# Altium schematic sheet BAT_PROTECTOR.SchDoc
size A4; SheetNumber: 4; SheetTotal: 4
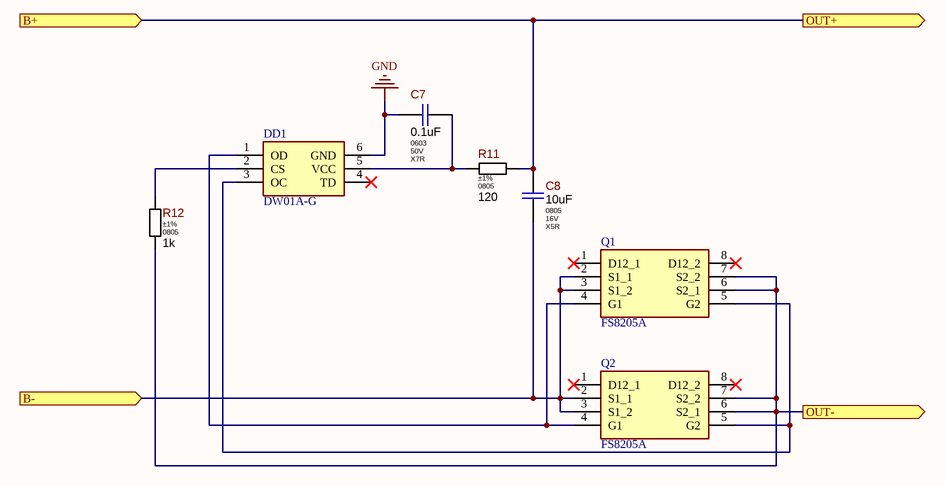
[diagram p0: BAT_PROTECTOR.SchDoc]

## Parts
C7  Package: 0603  Voltage: 50V  Dielectric Type: X7R  [C_CERAMIC_0603_MED]  (hidden comment: 0.1uF)
C8  Package: 0805  Voltage: 16V  Dielectric Type: X5R  [CAP-0805(2012)X125T15]  (hidden comment: 10uF)
DD1  DW01A-G  [DW01A-G]
Q1  FS8205A  [FS8205A]
Q2  FS8205A  [FS8205A]
R11  Tolerance: ±1%  Package: 0805  [R_ANY_CHIP_0805_MED]  (hidden comment: 120)
R12  Tolerance: ±1%  Package: 0805  [R_ANY_CHIP_0805_MED]  (hidden comment: 1k)

## Ports
B+ (in), B- (in), OUT+ (out), OUT- (out)

## Nets
GND: C7.1 DD1.6(GND)
B+: C8.1 R11.1 ; port B+, port OUT+
B-: C8.2 Q1.2(S1_1) Q1.3(S1_2) Q2.2(S1_1) Q2.3(S1_2) ; port B-
OUT-: Q1.6(S2_1) Q1.7(S2_2) Q2.6(S2_1) Q2.7(S2_2) R12.1 ; port OUT-
NetC7_2: C7.2 DD1.5(VCC) R11.2
NetDD1_1: DD1.1(OD) Q1.4(G1) Q2.4(G1)
NetDD1_2: DD1.2(CS) R12.2
NetDD1_3: DD1.3(OC) Q1.5(G2) Q2.5(G2)

Not connected (* = marked no-connect by the designer): DD1 4(TD)*; Q1 1(D12_1)* 8(D12_2)*; Q2 1(D12_1)* 8(D12_2)*

## Library data of the parts
C7 = CL10B104KB8NNND: 100nF 50V X7R ±10% 0603 Ceramic Capacitor RoHS; Manufacturer: Samsung Electro-Mechanics; Ajax_1C_ID: 21313; Ajax_1C_PN: 100nF 50V X7R 10% 0603 CL10B104KB8NNND ceramic capacitor SMD; Ajax_1С_Status: Substitution; Standard Lead Time: 18 Weeks; Component Status: Released; Replacement: CL10B104KB8NNNC; GUID_1C: f1fd6399-ca68-11ea-ab63-0050569f2651; Value: 0.1uF; Part Number: CL10B104KB8NNND; Part Type: Ceramic / X7R / 0603; Component Type: SMD; Temperature Range: -55°C ~ 125°C; Tolerance: ±10%; ComponentLink1URL: https://media.digikey.com/pdf/Data%20Sheets/Samsung%20PDFs/CL_Series_MLCC_ds.pdf; Supplier 1: Digi-Key; Supplier Part Number 1: CL10B104KB8NNND-ND; Price: 0,0039378; ComponentLink1Description: Datasheet
C8 = CL21A106KOQNNNE: 10uF 16V Х5R ±10% 0805 Ceramic Capacitor RoHS; Manufacturer: Samsung Electro-Mechanics; Ajax_1C_ID: 2350; Ajax_1C_PN: 10uF 16V Х5R 10% 0805 CL21A106KOQNNNE Ceramic Capacitor SMD RoHS; Ajax_1С_Status: Mass Production; Standard Lead Time: 22 Weeks; Component Status: Released; Replacement: NONE; GUID_1C: 272845d6-647b-11e2-9b5b-6c626deda1bb; Value: 10uF; Part Number: CL21A106KOQNNNE; Part Type: Ceramic / X5R / 0805; Component Type: SMD; Temperature Range: -55°C ~ 85°C; Tolerance: ±10%; ComponentLink1URL: https://media.digikey.com/pdf/Data%20Sheets/Samsung%20PDFs/CL_Series_MLCC_ds.pdf; Supplier 1: Digi-Key; Supplier Part Number 1: 1276-1096-2-ND; Price: 0,0072; ComponentLink1Description: Datasheet
DD1 = DW01A-G: One Cell Lithium-ion/Polymer Battery Protection IC
Q1 Q2 = FS8205A: Dual N-Channel Enahncement Mode Power MOSFET; Datasheet: https://www.ic-fortune.com/upload/Download/FS8205A-DS-12_EN.pdf; ComponentLink1Description: Data; ComponentLink1URL: https://www.ic-fortune.com/upload/Download/FS8205A-DS-12_EN.pdf
R11 = RC0805FR-07120RL: 120 Ohms ±1%, 1/8W 0805 Thick Film Resistor; Manufacturer: Yageo; Ajax_1C_ID: 14156; Ajax_1C_PN: 120R 1% 0805 Resistors SMD RoHS; Ajax_1С_Status: Mass Production; Power Rating: 0.125W; Voltage: 150V; Component Status: Released; Temperature Stability: ±100ppm/°C; Replacement: NONE; GUID_1C: b31bb40e-dc54-11e8-ab4a-0050569f2651; Value: 120; Part Number: RC0805FR-07120RL; Component Type: SMD; Part Type: Thick Film; Temperature Range: -55°C ~ 155°C; ComponentLink1URL: https://eu.mouser.com/datasheet/2/447/PYu_RC_Group_51_RoHS_L_10-1664068.pdf; Price: 0,0014; ComponentLink1Description: Datasheet
R12 = RC0805FR-071KL: 1 kOhms ±1%, 1/8W 0805 Thick Film Resistor; Manufacturer: Yageo; Ajax_1C_ID: 8520; Ajax_1C_PN: 1k 1% 0805 Resistors SMD RoHS; Ajax_1С_Status: Mass Production; Power Rating: 0.125W; Voltage: 150V; Component Status: Released; Temperature Stability: ±100ppm/°C; Replacement: NONE; GUID_1C: 0c53a8ec-2890-11e6-81ae-d8cb8a9acc66; Value: 1k; Part Number: RC0805FR-071KL; Component Type: SMD; Part Type: Thick Film; Temperature Range: -55°C ~ 155°C; ComponentLink1URL: https://eu.mouser.com/datasheet/2/447/PYu_RC_Group_51_RoHS_L_10-1664068.pdf; Supplier 1: Digi-Key; Supplier Part Number 1: 311-1.00KCRTR-ND; Price: 0,0014; ComponentLink1Description: Datasheet